# EAGLE design Controler-Board (EAGLE 7.2.0)
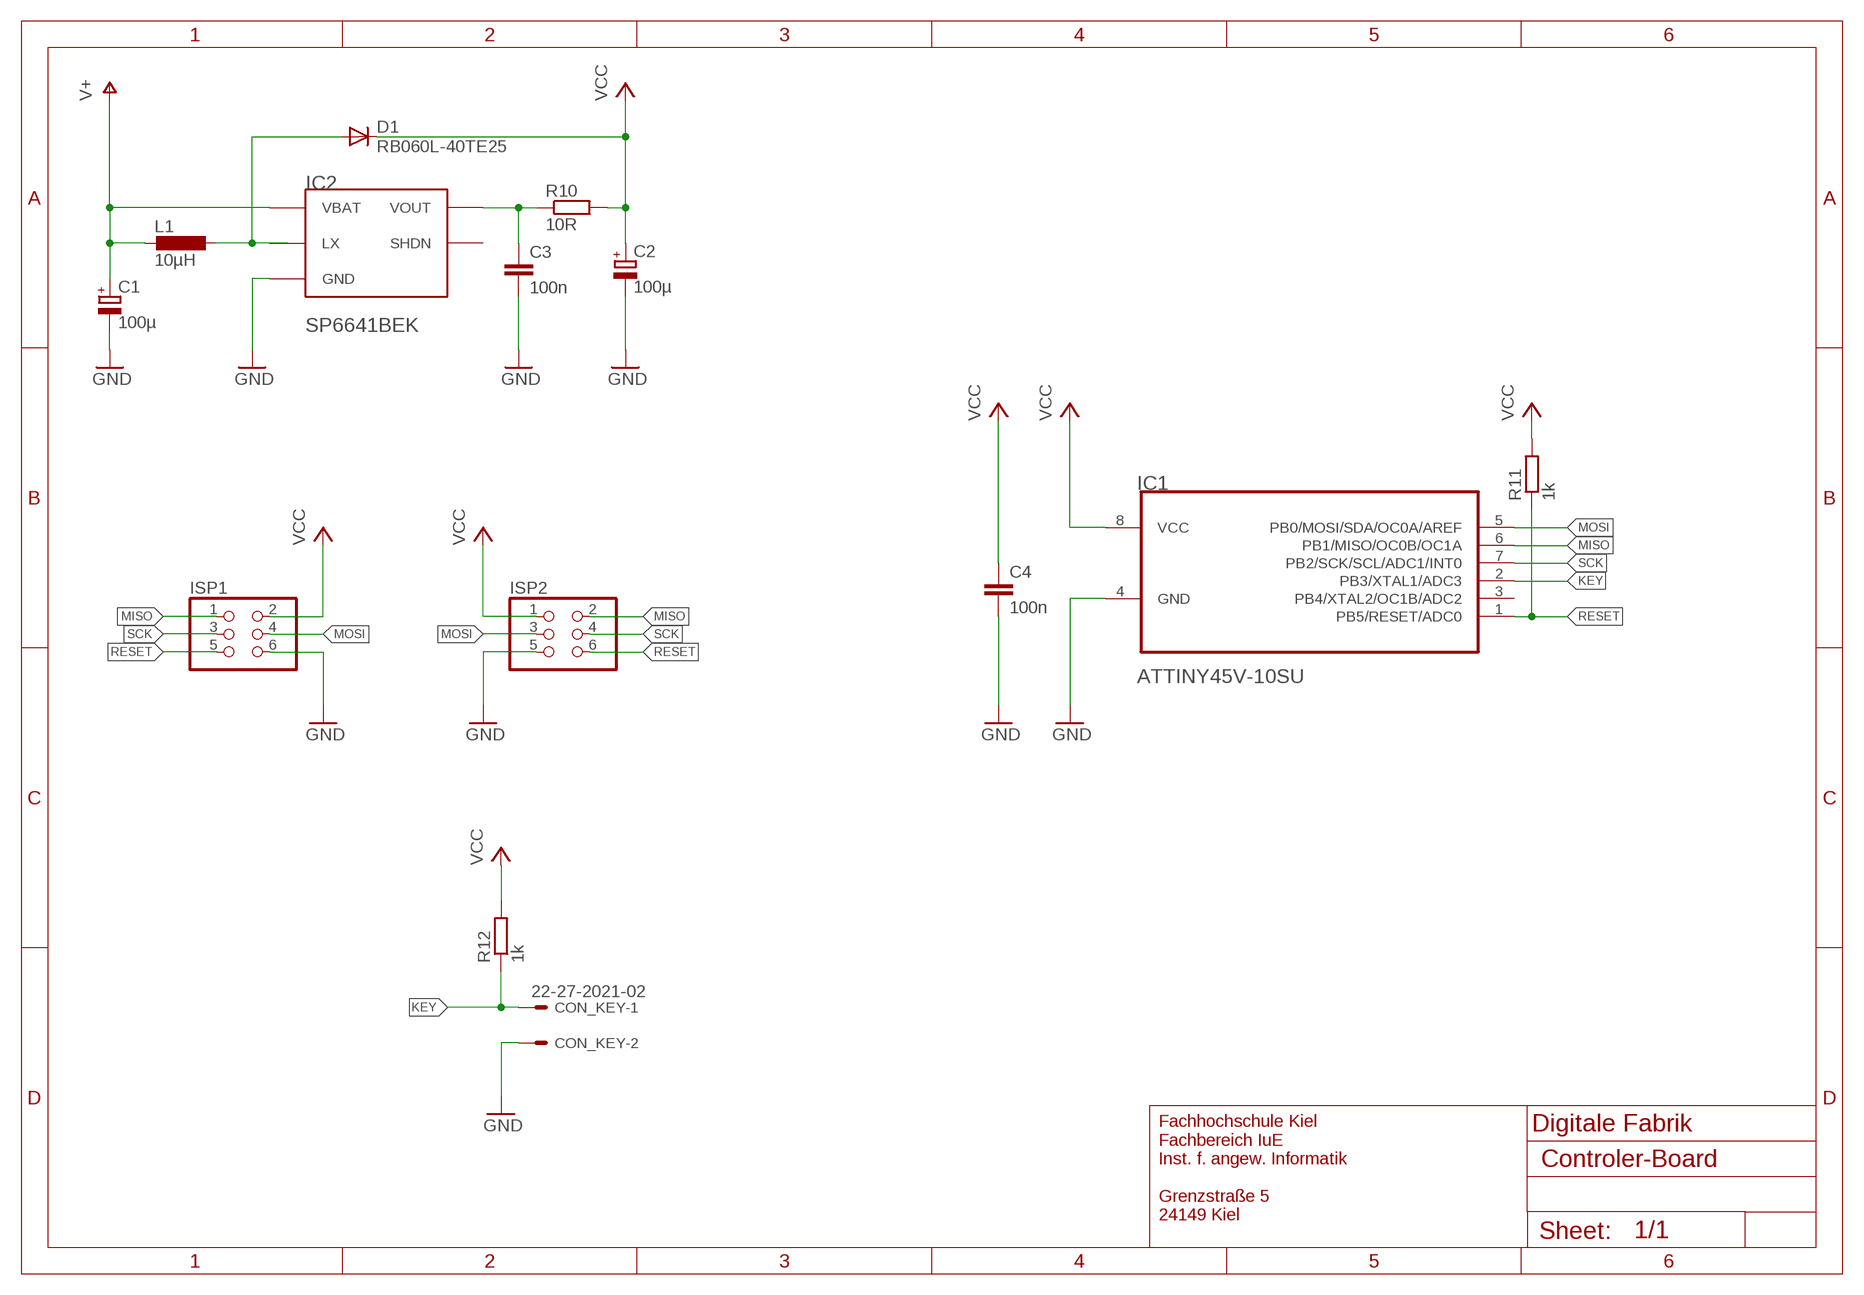
[diagram p0: schematic, sheet 1]

## Parts
C1  100µ  CPOL-EUC  [PANASONIC_C]
C2  100µ  CPOL-EUC  [PANASONIC_C]
C3  100n  C-EUC1206  [C1206]
C4  100n  C-EUC0805  [C0805]
CON_KEY  22-27-2021-02  [6410-02]
D1  RB060L-40TE25  DIODE-SOD106-R  [SOD106-R]
IC1  ATTINY45V-10SU  [SOIC127P798X216-8N]
IC2  SP6641BEK  [SOT23-5]
ISP1  PINHD-2X03_2.54-SMD  [2X03SMD]
ISP2  PINHD-2X03_2.54-SMD  [2X03SMD]
L1  10µH  L-EUL1206  [R1206]
R10  10R  R-EU_R0805  [R0805]
R11  1k  R-EU_R0805  [R0805]
R12  1k  R-EU_R0805  [R0805]

## Nets
GND: C1.- C2.- C3.2 C4.2 CON_KEY.2 IC1.4(GND) IC2.2(GND) ISP1.6 ISP2.5
KEY: CON_KEY.1 IC1.2(PB3/XTAL1/ADC3) R12.1
MISO: IC1.6(PB1/MISO/OC0B/OC1A) ISP1.1 ISP2.2
MOSI: IC1.5(PB0/MOSI/SDA/OC0A/AREF) ISP1.4 ISP2.3
N$10: C3.1 IC2.3(VOUT) R10.1
N$11: D1.A L1.1
RESET: IC1.1(PB5/RESET/ADC0) ISP1.5 ISP2.6 R11.1
SCK: IC1.7(PB2/SCK/SCL/ADC1/INT0) ISP1.3 ISP2.4
V+: C1.+ IC2.5(VBAT) L1.2
VCC: C2.+ C4.1 D1.C IC1.8(VCC) ISP1.2 ISP2.1 R10.2 R11.2 R12.2
Unconnected: IC1.3(PB4/XTAL2/OC1B/ADC2) IC2.1(LX) IC2.4(SHDN)

## Notes on the sheet
- Digitale Fabrik
- Fachhochschule Kiel
  Fachbereich IuE
  Inst. f. angew. Informatik
  
  Grenzstraße 5
  24149 Kiel

## Library data of the parts
C1 C2 = rcl:CPOL-EU: POLARIZED CAPACITOR, European symbol
C3 C4 = rcl:C-EU: CAPACITOR, European symbol
CON_KEY = con-molex:22-?-02: CONNECTOR wire to board 2.54 mm (.1 inch) pitch header
D1 = diode:DIODE-: DIODE
IC1 = attiny45:ATTINY45V-10SU: 8-bit Microcontroller with In-System Programmable Flash; MPN: ATTINY45V-10SU; OC_FARNELL: 1288355; OC_NEWARK: 23M5075; PACKAGE: SOIC-8; SUPPLIER: Atmel
IC2 = v-reg-3:SP6641BEK: 500mA Alkaline DC/DC Boost Regulator in SOT-23
ISP1 ISP2 = pinhead-2:PINHD-2X03: PIN HEADER
L1 = rcl:L-EU: INDUCTOR, European symbol
R10-R12 = rcl:R-EU_: RESISTOR, European symbol

## Board
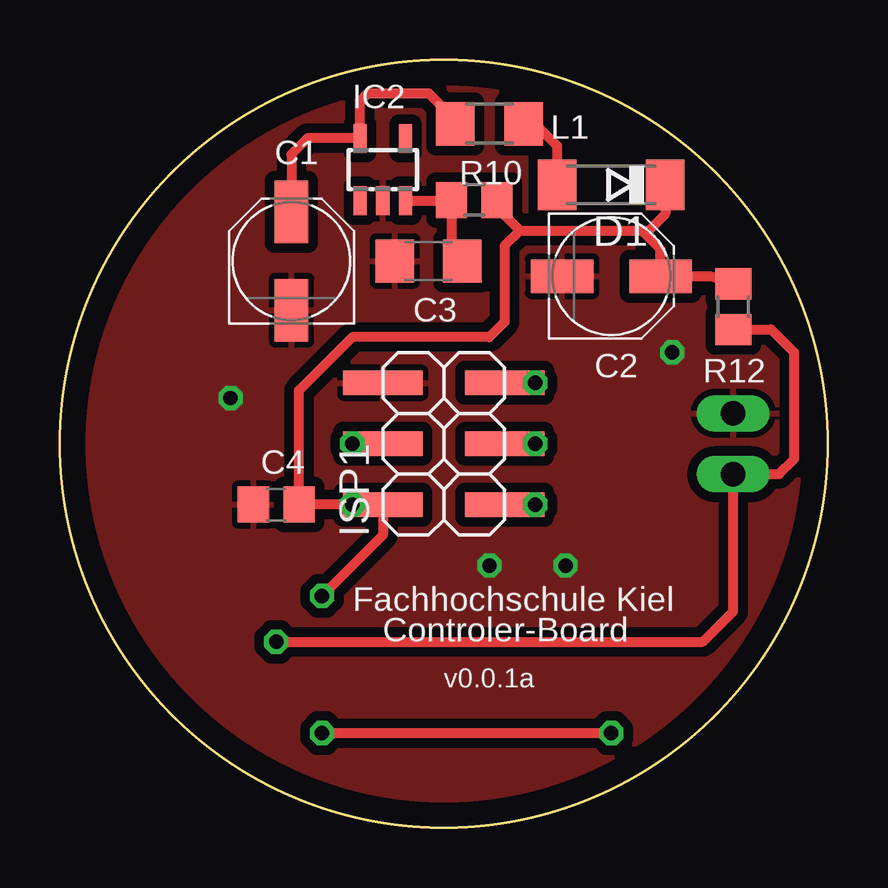
[diagram p1: board, top side]
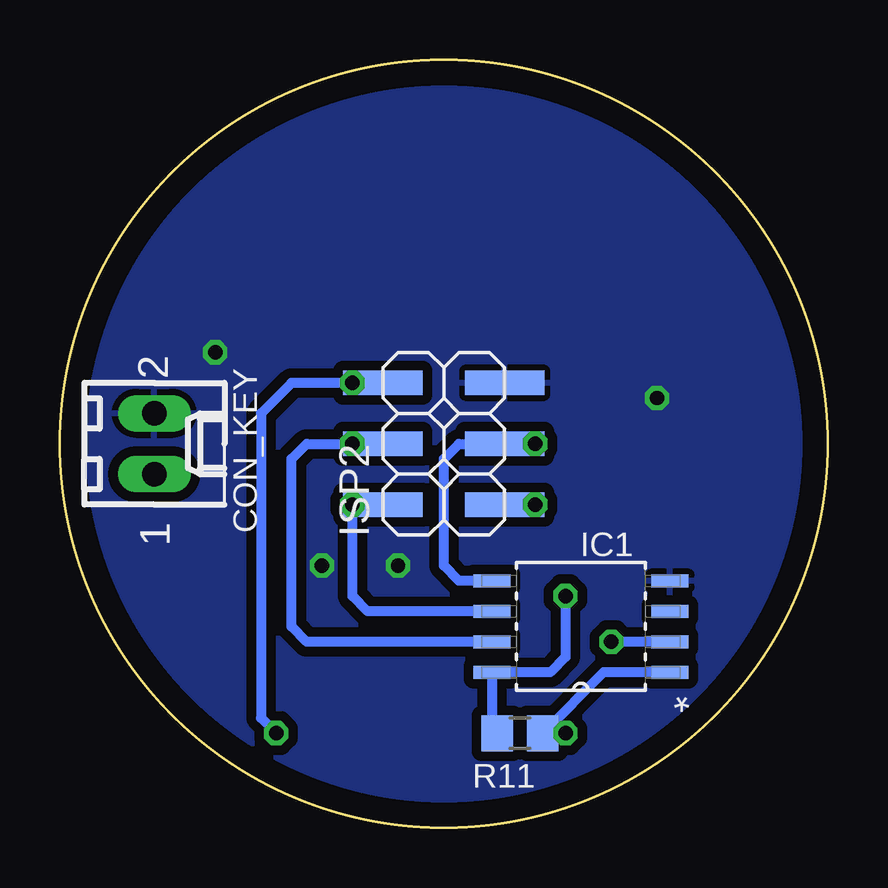
[diagram p2: board, bottom side, seen from below]

Size 32 x 32 mm. Coordinates in mm from the lower left corner, seen from the top.
Outline: circle at 16,16 radius 16
Copper layers (1*16): Top 0.035mm / dielectric 1.5mm / Bottom 0.035mm
Design rules "default": minimum track width 10mil, minimum drill 24mil, track to track 8mil, track to pad 8mil, pad to pad 8mil, via to via 8mil, smd to smd 8mil, copper to edge 40mil, drill to drill 8mil, minimum pad ring 10mil, minimum via ring 8mil, stop-mask expansion 4mil, vias tented up to drill 0mil, thermal gap 10mil

### Footprints (pad centres in the part's own frame; a part is rotated, then mirrored left to right if it is on the bottom)
PANASONIC_C = smd 2.6 x 1.4: + 2.05,0; - -2.05,0
C1206 = smd 1.6 x 1.8: 1 -1.4,0; 2 1.4,0
C0805 = smd 1.3 x 1.5: 1 -0.95,0; 2 0.95,0
6410-02 = drill 1.016 long: 1 1.27,0; 2 -1.27,0
SOD106-R = smd 1.6 x 2.1: A 2.25,0; C -2.25,0
SOIC127P798X216-8N = smd 1.549 x 0.533: 1 -3.708,1.905; 2 -3.708,0.635; 3 -3.708,-0.635; 4 -3.708,-1.905; 5 3.708,-1.905; 6 3.708,-0.635; 7 3.708,0.635; 8 3.708,1.905
SOT23-5 = smd 0.55 x 1.2: 1 -0.95,-1.3; 2 0,-1.3; 3 0.95,-1.3; 4 0.95,1.3; 5 -0.95,1.3
2X03SMD = smd 1.016 x 3.302: 1 -1.27,-3.81; 2 -1.27,1.27; 3 1.27,-3.81; 4 1.27,1.27; 5 3.81,-3.81; 6 3.81,1.27
R1206 = smd 1.6 x 1.803: 1 -1.422,0; 2 1.422,0
R0805 = smd 1.3 x 1.5: 1 -0.95,0; 2 0.95,0

### Placement (x,y rotation side)
C1  9.65,23.62 90 top
C2  22.98,22.98 0 top
C3  15.37,23.62 180 top
C4  9.02,13.46 180 top
CON_KEY  28.06,16 270 bottom
D1  22.98,26.8 180 top
IC1  10.29,8.38 180 bottom
IC2  13.46,27.43 0 top
ISP1  14.73,14.73 90 top
ISP2  17.27,14.73 90 bottom
L1  17.91,29.34 180 top
R10  17.27,26.16 0 top
R11  12.82,3.94 180 bottom
R12  28.06,21.71 90 top

### Tracks (layer width: path | path; a pad name or v marks a point on that pad's centre or on a via)
GND  (via drill 0.6)
  other vias: 7.11,17.91 17.91,10.92 21.08,10.92 25.52,19.81
  pour Top (isolate 0.406): 0.12,0.12 0.12,31.88 31.88,31.88 31.88,0.12
  pour Bottom (isolate 0.406): 0.76,0.12 0.12,0.12 0.12,31.88 31.88,31.88 31.88,0.12
KEY  (via drill 0.6)
  Top 0.406: R12.1 29.65,20.77 30.61,19.81 30.61,15.37 29.97,14.73 CON_KEY.1 28.06,9.02 26.8,7.74 v9.02,7.74
  Bottom 0.406: IC1.2 v9.02,7.74
MISO  (via drill 0.6)
  Top 0.406: v19.81,13.46 ISP2.2
  Bottom 0.406: ISP2.2 v19.81,13.46 19.81,9.65 19.18,9.02 IC1.6
MOSI  (via drill 0.6)
  Top 0.406: v12.19,16 ISP2.3
  Bottom 0.406: IC1.5 15.37,10.29 16,10.92 16,15.37 15.37,16 ISP2.3 v12.19,16
N$10
  Top 0.406: IC2.3 16.29,26.13 R10.1 16.32,24.06 C3.1
N$11
  Top 0.406: D1.A 20.73,28.41 19.81,29.34 L1.1
RESET  (via drill 0.6)
  Top 0.406: v19.81,18.54 ISP2.6 | v22.98,3.94 v10.92,3.94
  Bottom 0.406: IC1.1 9.34,6.47 R11.1 v10.92,3.94 | v19.81,18.54 ISP2.6 22.35,18.54 23.62,17.27 23.62,4.57 v22.98,3.94
SCK  (via drill 0.6)
  Top 0.406: ISP2.4 v19.81,16
  Bottom 0.406: ISP2.4 v19.81,16 21.71,16 22.35,15.37 22.35,8.38 21.71,7.74 IC1.7
V+
  Top 0.406: L1.2 16,29.82 16,29.97 15.37,30.61 12.82,30.61 12.51,30.29 IC2.5 10.32,28.73 9.65,28.06 C1.+
VCC  (via drill 0.6)
  Top 0.406: R10.2 18.22,25.84 19.18,24.89 | 19.18,24.89 24.26,24.89 | 24.26,24.89 24.55,24.89 25.23,25.58 D1.C | R12.2 27.11,22.98 C2.+ 25.04,24.11 24.26,24.89 | v10.92,9.65 13.46,12.19 ISP2.1 v12.19,13.46 C4.1 9.96,18.22 12.19,20.45 17.91,20.45 18.54,21.08 18.54,24.26 19.18,24.89
  Bottom 0.406: R11.2 13.99,4.15 IC1.8 11.55,6.47 10.92,7.11 v10.92,9.65 | ISP2.1 v12.19,13.46

### Text on the board
tNames: Fachhochschule Kiel | Controler-Board | v0.0.1a